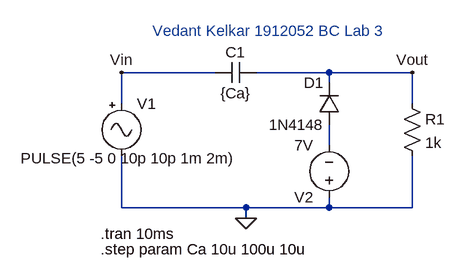
[diagram p0: schematic Draft19.asc]
Draft19.asc, the LTspice schematic file:
Version 4
SHEET 1 880 680
WIRE 112 48 -32 48
WIRE 288 48 176 48
WIRE 416 48 288 48
WIRE 288 64 288 48
WIRE -32 96 -32 48
WIRE 416 96 416 48
WIRE 288 160 288 128
WIRE -32 256 -32 176
WIRE 160 256 -32 256
WIRE 288 256 288 240
WIRE 288 256 160 256
WIRE 416 256 416 176
WIRE 416 256 288 256
WIRE 160 272 160 256
FLAG -32 48 Vin
FLAG 416 48 Vout
FLAG 160 272 0
SYMBOL diode 304 128 R180
WINDOW 0 24 64 Left 2
WINDOW 3 24 0 Left 2
SYMATTR InstName D1
SYMATTR Value 1N4148
SYMBOL res 400 80 R0
SYMATTR InstName R1
SYMATTR Value 1k
SYMBOL Misc\\signal -32 80 R0
WINDOW 3 -155 100 Left 2
WINDOW 123 0 0 Left 0
WINDOW 39 0 0 Left 0
SYMATTR InstName V1
SYMATTR Value PULSE(5 -5 0 10p 10p 1m 2m)
SYMBOL cap 176 32 R90
WINDOW 0 0 32 VBottom 2
WINDOW 3 32 32 VTop 2
SYMATTR InstName C1
SYMATTR Value {Ca}
SYMBOL voltage 288 256 R180
WINDOW 123 0 0 Left 0
WINDOW 39 0 0 Left 0
SYMATTR InstName V2
SYMATTR Value 7V
TEXT 16 -16 Left 2 ;Vedant Kelkar 1912052 BC Lab 3
TEXT -64 296 Left 2 !.tran 10ms
TEXT -64 320 Left 2 !.step param Ca 10u 100u 10u

The netlist it stands for:
* Draft19.asc
D1 N001 Vout 1N4148
R1 Vout 0 1k
V1 Vin 0 PULSE(5 -5 0 10p 10p 1m 2m)
C1 Vout Vin {Ca}
V2 0 N001 7V
.model D D
.lib standard.dio
* Vedant Kelkar 1912052 BC Lab 3
.tran 10ms
.step param Ca 10u 100u 10u
.backanno
.end